# Altium schematic sheet 10 Audio Out.SchDoc
size B; DocumentNumber: 10; SheetNumber: 10; SheetTotal: 17
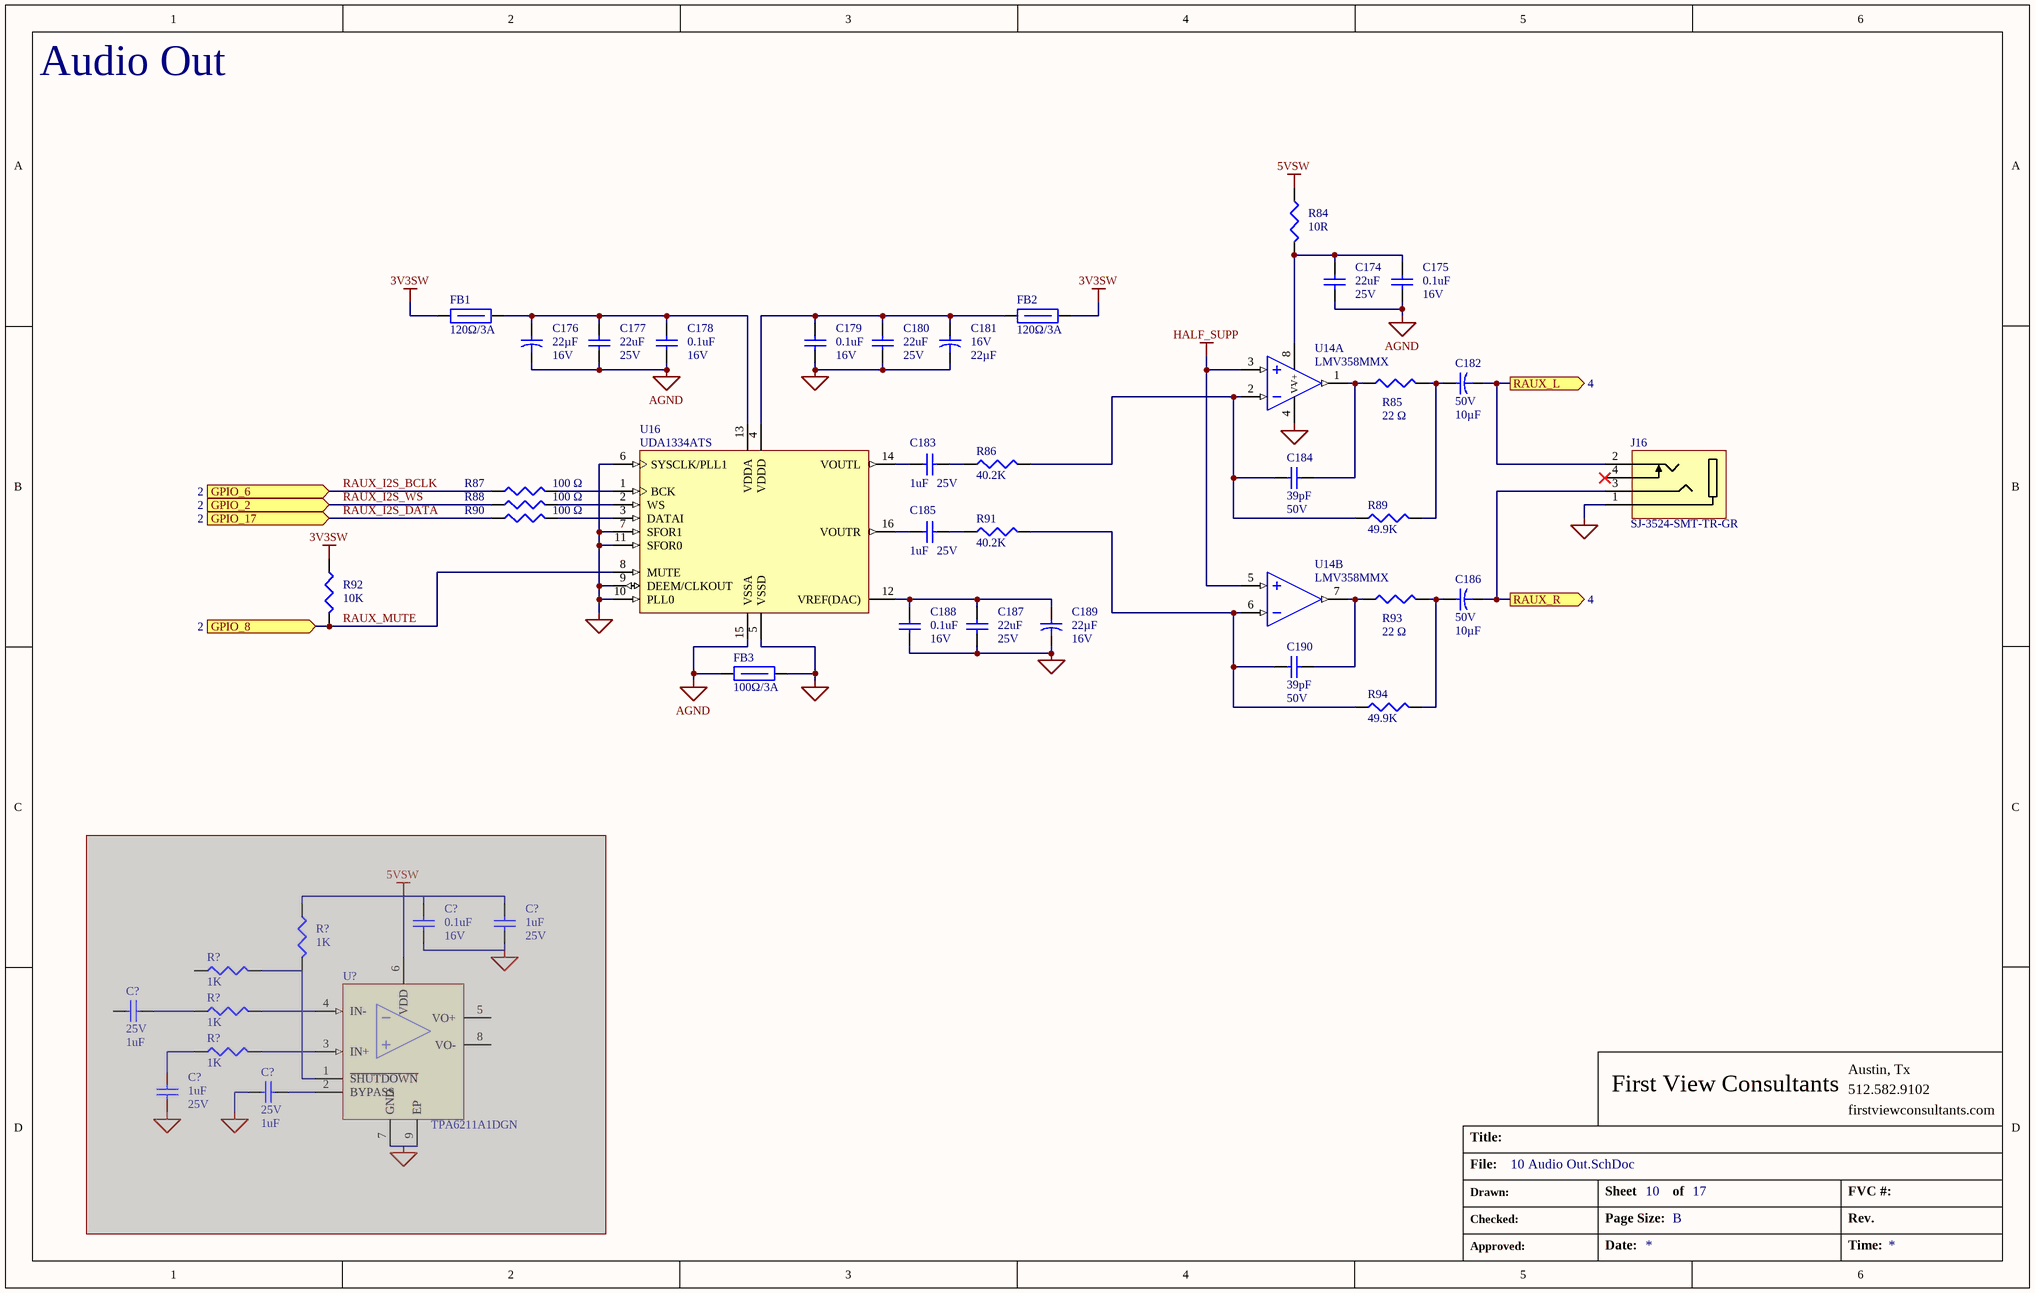
[diagram p0: 10 Audio Out.SchDoc]

## Parts
(Parts that share a designator on the sheet are numbered #1, #2 ... from top to bottom, then left to right.)
C174  value 22uF  Voltage: 25V  [CAP_0805]  (hidden comment: Cap 22uF 25V 0805)
C175  value 0.1uF  Voltage: 16V  [CAP_0402]  (hidden comment: Cap 0.1uF 16V 0402)
C176  value 22µF  Voltage: 16V  [SMD(5.3x5.3)_UWX1C220MCL1GB]  (hidden comment: Cap 22µF 16V)
C177  value 22uF  Voltage: 25V  [CAP_0805]  (hidden comment: Cap 22uF 25V 0805)
C178  value 0.1uF  Voltage: 16V  [CAP_0402]  (hidden comment: Cap 0.1uF 16V 0402)
C179  value 0.1uF  Voltage: 16V  [CAP_0402]  (hidden comment: Cap 0.1uF 16V 0402)
C180  value 22uF  Voltage: 25V  [CAP_0805]  (hidden comment: Cap 22uF 25V 0805)
C181  value 22µF  Voltage: 16V  [SMD(5.3x5.3)_UWX1C220MCL1GB]  (hidden comment: Cap 22µF 16V)
C182  value 10µF  Voltage: 50V  [SMD(6.6x6.6)_UWX1H100MCL1GB]  (hidden comment: Cap 10µF 50V)
C183  value 1uF  Voltage: 25V  [CAP_0402]  (hidden comment: Cap 1uF 25V 0402)
C184  value 39pF  Voltage: 50V  [CAP_0402]  (hidden comment: Cap 39pF 50V 0402)
C185  value 1uF  Voltage: 25V  [CAP_0402]  (hidden comment: Cap 1uF 25V 0402)
C186  value 10µF  Voltage: 50V  [SMD(6.6x6.6)_UWX1H100MCL1GB]  (hidden comment: Cap 10µF 50V)
C187  value 22uF  Voltage: 25V  [CAP_0805]  (hidden comment: Cap 22uF 25V 0805)
C188  value 0.1uF  Voltage: 16V  [CAP_0402]  (hidden comment: Cap 0.1uF 16V 0402)
C189  value 22µF  Voltage: 16V  [SMD(5.3x5.3)_UWX1C220MCL1GB]  (hidden comment: Cap 22µF 16V)
C190  value 39pF  Voltage: 50V  [CAP_0402]  (hidden comment: Cap 39pF 50V 0402)
C?#1  value 0.1uF  Voltage: 16V  [CAP_0402]  (hidden comment: Cap 0.1uF 16V 0402)  (masked out: inside a compile mask, not in the netlist)
C?#2  value 1uF  Voltage: 25V  [CAP_0402]  (hidden comment: Cap 1uF 25V 0402)  (masked out: inside a compile mask, not in the netlist)
C?#3  value 1uF  Voltage: 25V  [CAP_0402]  (hidden comment: Cap 1uF 25V 0402)  (masked out: inside a compile mask, not in the netlist)
C?#4  value 1uF  Voltage: 25V  [CAP_0402]  (hidden comment: Cap 1uF 25V 0402)  (masked out: inside a compile mask, not in the netlist)
C?#5  value 1uF  Voltage: 25V  [CAP_0402]  (hidden comment: Cap 1uF 25V 0402)  (masked out: inside a compile mask, not in the netlist)
FB1  value 120Ω/3A  [IND_0603]  (hidden comment: BLM18KG121TN1D)
FB2  value 120Ω/3A  [IND_0603]  (hidden comment: BLM18KG121TN1D)
FB3  value 100Ω/3A  [IND_0603]  (hidden comment: BLM18KG101TN1D)
J16  SJ-3524-SMT-TR-GR  [CON_SJ-3524-SMT-TR-GR]
R84  value 10R  [RES_0402]  (hidden comment: Res 10R 0.1W)
R85  value 22 Ω  [RES_0402]  (hidden comment: Res 22R 0.063W)
R86  value 40.2K  [RES_0402]  (hidden comment: Res 40.2K 0.1W)
R87  value 100 Ω  [RES_0402]  (hidden comment: Res 100R 0.063W)
R88  value 100 Ω  [RES_0402]  (hidden comment: Res 100R 0.063W)
R89  value 49.9K  [RES_0402]  (hidden comment: Res 49.9K 0.063W)
R90  value 100 Ω  [RES_0402]  (hidden comment: Res 100R 0.063W)
R91  value 40.2K  [RES_0402]  (hidden comment: Res 40.2K 0.1W)
R92  value 10K  [RES_0402]  (hidden comment: Res 10K 0.063W)
R93  value 22 Ω  [RES_0402]  (hidden comment: Res 22R 0.063W)
R94  value 49.9K  [RES_0402]  (hidden comment: Res 49.9K 0.063W)
R?#1  value 1K  [RES_0402]  (hidden comment: Res 1K 0.063W)  (masked out: inside a compile mask, not in the netlist)
R?#2  value 1K  [RES_0402]  (hidden comment: Res 1K 0.063W)  (masked out: inside a compile mask, not in the netlist)
R?#3  value 1K  [RES_0402]  (hidden comment: Res 1K 0.063W)  (masked out: inside a compile mask, not in the netlist)
R?#4  value 1K  [RES_0402]  (hidden comment: Res 1K 0.063W)  (masked out: inside a compile mask, not in the netlist)
U14  LMV358MMX  [VSSOP-8_LMV358MMX]  (parts A,B of 2)
U16  UDA1334ATS  [SSOP-16_UDA1334ATS]
U?  TPA6211A1DGN  [MSOP-8_TPA6211A1DGN]  (masked out: inside a compile mask, not in the netlist)

## Ports
GPIO_2 (in, see 2), GPIO_6 (in, see 2), GPIO_8 (in, see 2), GPIO_17 (in, see 2), RAUX_L (out, see 4), RAUX_R (out, see 4)

## Nets
3V3SW: FB1.1 FB2.1 R92.1
5VSW: R84.1
AGND: C174.2 C175.2 C176.2 C177.2 C178.2 FB3.1 U16.15(VSSA)
GND: C179.2 C180.2 C181.2 C187.2 C188.2 C189.2 FB3.2 J16.1(SLEEVE) U14.4(V-) U16.5(VSSD) U16.6(SYSCLK/PLL1) U16.7(SFOR1) U16.9(DEEM/CLKOUT) U16.10(PLL0) U16.11(SFOR0)
HALF_SUPP: U14.3(INA+) U14.5(INB+)
RAUX_I2S_BCLK: R87.1 ; port GPIO_6
RAUX_I2S_DATA: R90.1 ; port GPIO_17
RAUX_I2S_WS: R88.1 ; port GPIO_2
RAUX_L: C182.2 J16.2(TIP) ; port RAUX_L
RAUX_MUTE: R92.2 U16.8(MUTE) ; port GPIO_8
RAUX_R: C186.2 J16.3(RING) ; port RAUX_R
NetC174_1: C174.1 C175.1 R84.2 U14.8(V+)
NetC176_1: C176.1 C177.1 C178.1 FB1.2 U16.13(VDDA)
NetC179_1: C179.1 C180.1 C181.1 FB2.2 U16.4(VDDD)
NetC182_1: C182.1 R85.2 R89.2
NetC183_1: C183.1 U16.14(VOUTL)
NetC183_2: C183.2 R86.1
NetC184_1: C184.1 R86.2 R89.1 U14.2(INA-)
NetC184_2: C184.2 R85.1 U14.1(OUTA)
NetC185_1: C185.1 U16.16(VOUTR)
NetC185_2: C185.2 R91.1
NetC186_1: C186.1 R93.2 R94.2
NetC187_1: C187.1 C188.1 C189.1 U16.12(VREF(DAC))
NetC190_1: C190.1 R91.2 R94.1 U14.6(INB-)
NetC190_2: C190.2 R93.1 U14.7(OUTB)
NetR87_2: R87.2 U16.1(BCK)
NetR88_2: R88.2 U16.2(WS)
NetR90_2: R90.2 U16.3(DATAI)

Not connected (* = marked no-connect by the designer): J16 4(TIP_SW)*

## Notes on the sheet
- Audio Out
- First View Consultants
- Austin, Tx
- 512.582.9102
- Title:
- File:
- firstviewconsultants.com
- Drawn:
- Checked:
- Sheet
- Page Size:
- of
- B
- FVC #:
- Rev.
- Approved:
- Date:
- Time:

## Library data of the parts
C174 C177 C180 C187 = Cap 22uF 25V 0805: Cap, Cer, 22uF, 25V, 20%, X5R, 0805; Manufacturer #: CL21A226MAQNNNE; Manufacturer: Samsung Electro-Mechanics America, Inc; Have Footprint: yes; Tolerance: ±20%; Package: 0805
C175 C178 C179 C188 C?#1 = Cap 0.1uF 16V 0402: Cap, Cer, 0.1uF, 16V, 10%, X7R, 0402; Manufacturer #: GRM155R71C104KA88D; Manufacturer: Murata Electronics North America; Have Footprint: yes; Package: 0402; Tolerance: ±10%
C176 C181 C189 = Cap 22µF 16V: Cap, Alum, 22µF, 16V, 20%, SMD; Manufacturer #: UWX1C220MCL1GB; Manufacturer: Nichicon; Tolerance: 20%; Package: SMD  (5.3x5.3); Operating Temperature: -40°C ~ 85°C
C182 C186 = Cap 10µF 50V: Cap, Alum, 10µF, 50V, 20%, SMD; Manufacturer #: UWX1H100MCL1GB; Manufacturer: Nichicon; Tolerance: 20%; Package: SMD (6.6x6.6); Operating Temperature: -40°C ~ 85°C
C183 C185 C?#2-C?#5 = Cap 1uF 25V 0402: Cap, Cer, 1uF, 25V, 10%, X5R, 0402; Manufacturer #: TMK105BJ105MV-F; Manufacturer: Taiyo Yuden; Have Footprint: yes; Package: 0402
C184 C190 = Cap 39pF 50V 0402: Cap, Cer, 39pF, 50V, 5%, C0G/NP0, 0402; Manufacturer: Yageo; Manufacturer #: CC0402JRNPO9BN390; Have Footprint: yes; Tolerance: 5%; PACKAGE: 0402; Operating Temperature: -55°C ~ 125°C
FB1 FB2 = BLM18KG121TN1D: Ind, Ferrite Bead, 120R, 20mOhm, 3A, 0603; Manufacturer: Murata Electronics North America; Have Footprint: yes; RoHS: yes; Package: 0603; Manufacturer #: BLM18KG121TN1D
FB3 = BLM18KG101TN1D: Ind, Ferrite Bead, 100R, 30mOhm, 3A, 0603; Manufacturer: Murata Electronics North America; Have Footprint: yes; RoHS: yes; Package: 0603; Manufacturer #: BLM18KG101TN1D
J16 = SJ-3524-SMT-TR-GR: Conn, Audio Jack, 3.5mm, Green, SMD; Manufacturer: CUI Inc; Operating Temperature: -20°C ~ 85°C; Manufacturer #: SJ-3524-SMT-TR-GR
R84 = Res 10R 0.1W: Res, 10R, 0.1W, 0402; Manufacturer #: ERJ-2GEJ100X; Manufacturer: Panasonic Electronic Components; Have Footprint: yes; Package: 0402
R85 R93 = Res 22R 0.063W: Res, 22R, 0.063W, 1%, 0402; Manufacturer #: RC0402FR-0722RL; Manufacturer: Yageo; Have Footprint: yes; Tolerance: ±1%; RoHS: yes; Cost: *; Package: 0402
R86 R91 = Res 40.2K 0.1W: Res, 40.2K, 0.1W, 1%, 0402; Manufacturer #: ERJ-2RKF4022X; Manufacturer: Panasonic Electronic Components; Have Footprint: yes; Package: 0402
R87 R88 R90 = Res 100R 0.063W: Res, 100R, 0.063W, 1%, 0402; Manufacturer #: TRR01MZPF1000; Manufacturer: Murata Electronics North America; Have Footprint: yes; Package: 0402
R89 R94 = Res 49.9K 0.063W: Res, 49.9K, 0.063W, 1%, 0402; Manufacturer #: MCR01MRTF4992; Manufacturer: Rohm Semiconductor; Have Footprint: yes; Package: 0402; Operating Temperature: -55°C ~ 155°C
R92 = Res 10K 0.063W: Res, 10K, 1/16W, 1%, 0402; Manufacturer #: RC0402FR-0710KL; Manufacturer: Yageo; Have Footprint: yes; Package: 0402
R?#1-R?#4 = Res 1K 0.063W: Res, 1K, 0.063W, 1%, 0402; Manufacturer #: CRCW04021K00FKED; Manufacturer: Vishay Dale; Have Footprint: yes; Package: 0402; Tolerance: ±1%
U14 = LMV358MMX: IC, Dual Op Amp, 2.7-5V, VSSOP-8; Manufacturer: Texas Instruments; Have Footprint: yes; RoHS: yes; Manufacturer #: LMV358MMX
U16 = UDA1334ATS: IC, DAC, I2S, 2.4-3.6V, 2-ch, 24-bit, SSOP-16; Manufacturer: NXP Semiconductor; Package: SSOP-16; Manufacturer #: UDA1334ATS
U? = TPA6211A1DGN: IC, Amp, 3.1W, 2.5-5.5V, MSOP-8; Manufacturer: Texas Instruments; Have Footprint: yes; Package: MSOP-8; RoHS: yes; Manufacturer #: TPA6211A1DGN